# EAGLE design schematic (EAGLE 9.6.2)
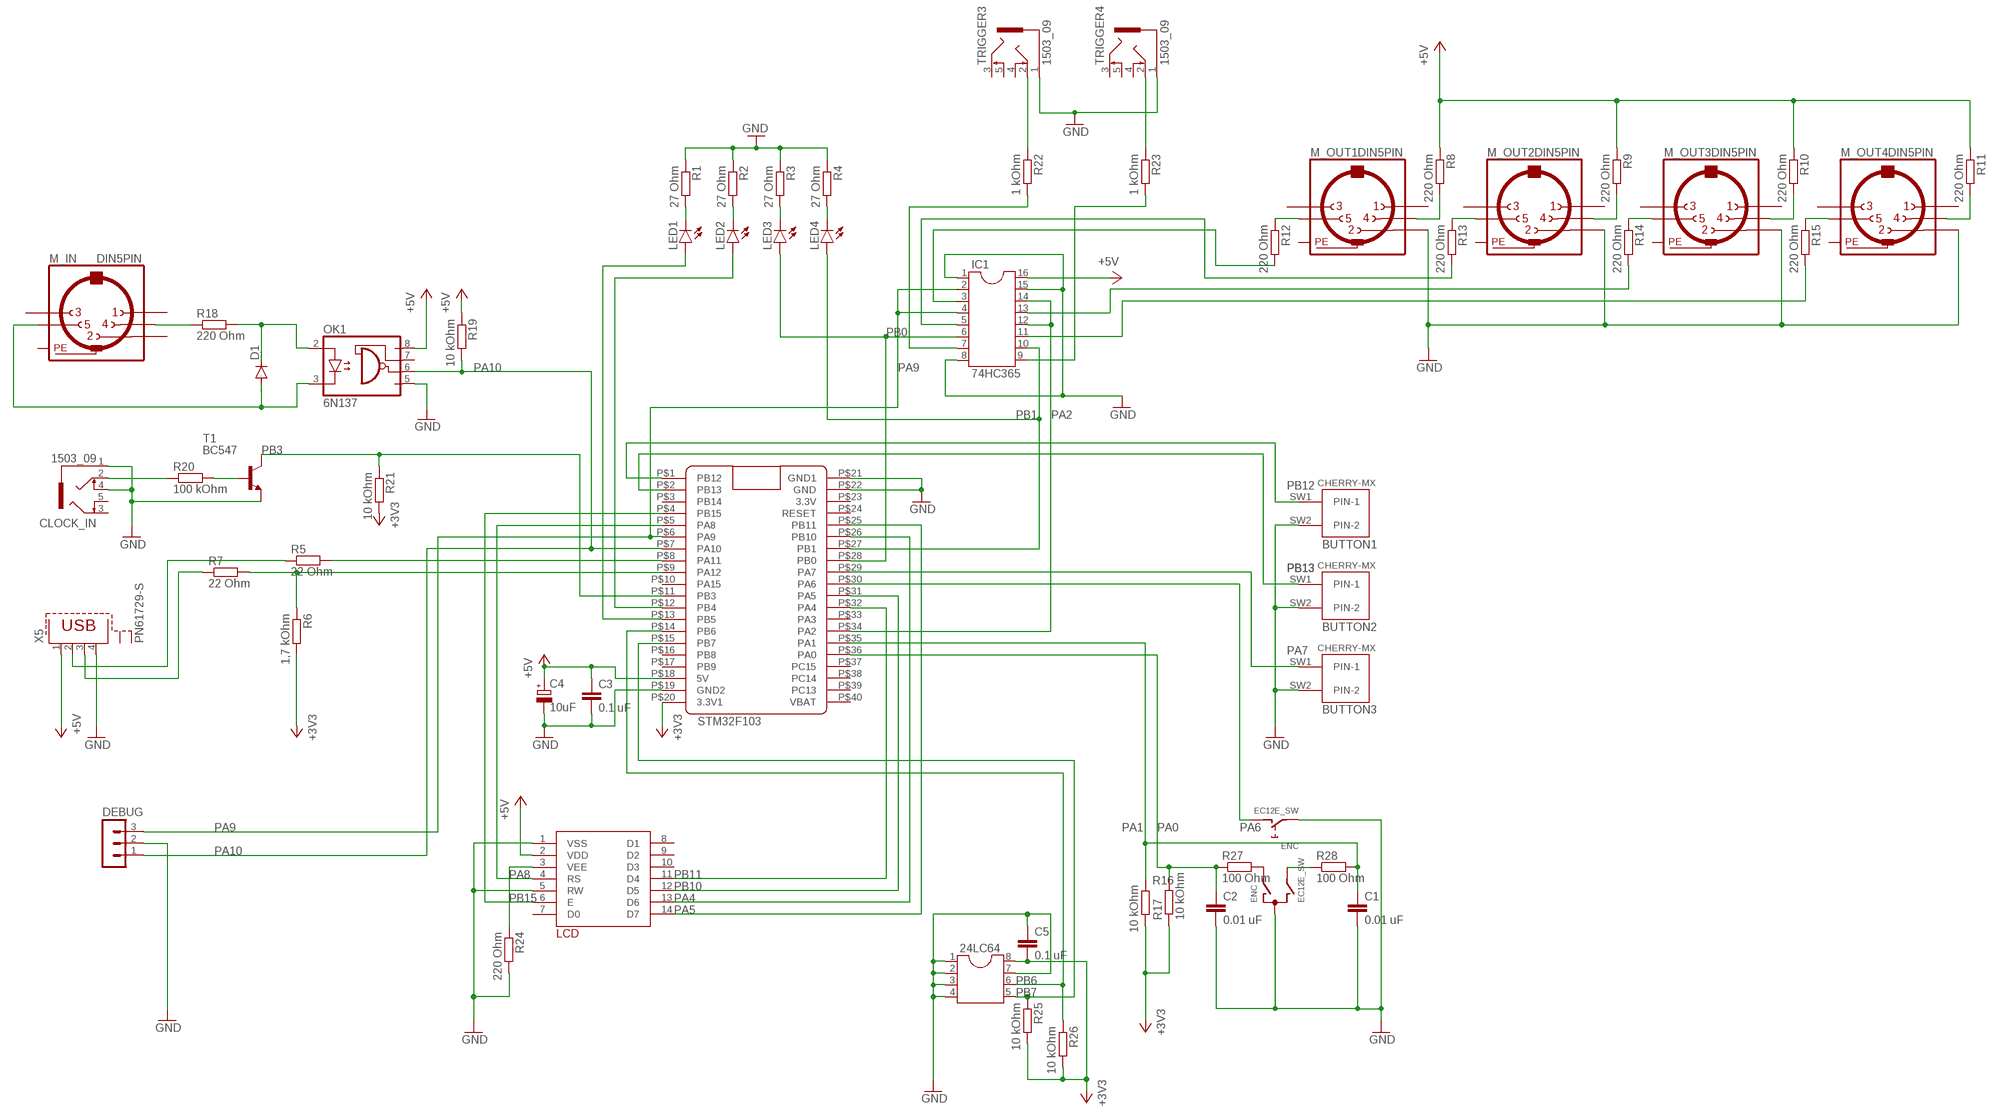
[diagram p0: schematic, sheet 1]

## Parts
24LC64  DIL8  [DIL08]
BUTTON1  CHERRY-MX  [CHERRY-MX]
BUTTON2  CHERRY-MX  [CHERRY-MX]
BUTTON3  CHERRY-MX  [CHERRY-MX]
C1  0.01 uF  C-EU050-025X075  [C050-025X075]
C2  0.01 uF  C-EU050-025X075  [C050-025X075]
C3  0.1 uF  C-EU050-025X075  [C050-025X075]
C4  10uF  CPOL-EUE2.5-6  [E2,5-6]
C5  0.1 uF  C-EU050-025X075  [C050-025X075]
CLOCK_IN  1503_09  [1503_09]
D1  1N4446  [DO35-10]
DEBUG  MA03-1  [MA03-1]
ENC  EC12E_SW  [ALPS_EC12E_SW]
IC1  74HC365  DIL16S  [SOCKET-16]
LCD  LCD-MODUL2X8  [LCD-MODUL2X8]
LED1  LED3MM  [LED3MM]
LED2  LED3MM  [LED3MM]
LED3  LED3MM  [LED3MM]
LED4  LED3MM  [LED3MM]
M_IN  DIN5PIN  [MABPM5S]
M_OUT1  DIN5PIN  [MABPM5S]
M_OUT2  DIN5PIN  [MABPM5S]
M_OUT3  DIN5PIN  [MABPM5S]
M_OUT4  DIN5PIN  [MABPM5S]
OK1  6N137  [DIL08]
R1  27 Ohm  R-EU_0207/10  [0207/10]
R2  27 Ohm  R-EU_0207/10  [0207/10]
R3  27 Ohm  R-EU_0207/10  [0207/10]
R4  27 Ohm  R-EU_0207/10  [0207/10]
R5  22 Ohm  R-EU_0207/10  [0207/10]
R6  1,7 kOhm  R-EU_0207/10  [0207/10]
R7  22 Ohm  R-EU_0207/10  [0207/10]
R8  220 Ohm  R-EU_0207/10  [0207/10]
R9  220 Ohm  R-EU_0207/10  [0207/10]
R10  220 Ohm  R-EU_0207/10  [0207/10]
R11  220 Ohm  R-EU_0207/10  [0207/10]
R12  220 Ohm  R-EU_0207/10  [0207/10]
R13  220 Ohm  R-EU_0207/10  [0207/10]
R14  220 Ohm  R-EU_0207/10  [0207/10]
R15  220 Ohm  R-EU_0207/10  [0207/10]
R16  10 kOhm  R-EU_0207/10  [0207/10]
R17  10 kOhm  R-EU_0207/10  [0207/10]
R18  220 Ohm  R-EU_0207/10  [0207/10]
R19  10 kOhm  R-EU_0207/10  [0207/10]
R20  100 kOhm  R-EU_0207/10  [0207/10]
R21  10 kOhm  R-EU_0207/10  [0207/10]
R22  1 kOhm  R-EU_0207/10  [0207/10]
R23  1 kOhm  R-EU_0207/10  [0207/10]
R24  220 Ohm  R-EU_0207/10  [0207/10]
R25  10 kOhm  R-EU_0207/10  [0207/10]
R26  10 kOhm  R-EU_0207/10  [0207/10]
R27  100 Ohm  R-EU_0207/10  [0207/10]
R28  100 Ohm  R-EU_0207/10  [0207/10]
STM32F103  BLUE_PILL  [BLUE_PILL]
T1  BC547  [TO92]
TRIGGER3  1503_09  [1503_09]
TRIGGER4  1503_09  [1503_09]
X5  PN61729-S  [PN61729-S]

## Nets
+3V3: 24LC64.8 C5.2 R6.2 R16.2 R17.1 R21.2 R25.2 R26.2 STM32F103.P$20(3.3V1)
+5V: C3.1 C4.+ IC1.16 LCD.2(VDD) OK1.8(VCC) R8.1 R9.1 R10.1 R11.1 R19.1 STM32F103.P$18(5V) X5.1
GND: 24LC64.1 24LC64.2 24LC64.3 24LC64.4 24LC64.7 BUTTON1.SW2(PIN-2) BUTTON2.SW2(PIN-2) BUTTON3.SW2(PIN-2) C1.2 C2.2 C3.2 C4.- C5.1 CLOCK_IN.1 CLOCK_IN.4 DEBUG.2 ENC.C ENC.E IC1.1 IC1.8 IC1.15 LCD.1(VSS) LCD.5(RW) M_OUT1.P2 M_OUT2.P2 M_OUT3.P2 M_OUT4.P2 OK1.5(GND) R1.1 R2.1 R3.1 R4.1 R24.2 STM32F103.P$19(GND2) STM32F103.P$21(GND1) STM32F103.P$22(GND) T1.1(E) TRIGGER3.1 TRIGGER4.1 X5.4
N$1: R5.1 X5.2
N$2: R5.2 STM32F103.P$8(PA11)
N$3: R7.1 X5.3
N$4: LED1.K(C) R1.2
N$5: LED2.K(C) R2.2
N$6: LED3.K(C) R3.2
N$7: LED4.K(C) R4.2
N$8: R6.1 R7.2 STM32F103.P$9(PA12)
N$9: M_OUT1.P4 R8.2
N$10: M_OUT2.P4 R9.2
N$11: M_OUT3.P4 R10.2
N$12: M_OUT4.P4 R11.2
N$13: M_OUT1.P5 R12.1
N$14: M_OUT2.P5 R13.1
N$15: M_OUT3.P5 R14.1
N$16: M_OUT4.P5 R15.1
N$17: IC1.3 R12.2
N$18: IC1.5 R13.2
N$19: IC1.13 R14.2
N$20: IC1.11 R15.2
N$21: ENC.A R27.2
N$22: ENC.B R28.1
N$24: D1.C OK1.2(A) R18.2
N$25: D1.A M_IN.P5 OK1.3(C)
N$26: M_IN.P4 R18.1
N$27: LCD.3(VEE) R24.1
N$28: CLOCK_IN.2 R20.1
N$29: R20.2 T1.2(B)
N$30: R22.1 TRIGGER3.2
N$31: IC1.7 R22.2
N$33: R23.1 TRIGGER4.2
N$34: IC1.9 R23.2
PA0: C2.1 R17.2 R27.1 STM32F103.P$36(PA0)
PA1: C1.1 R16.1 R28.2 STM32F103.P$35(PA1)
PA2: IC1.12 IC1.14 STM32F103.P$34(PA2)
PA4: LCD.11(D4) STM32F103.P$32(PA4)
PA5: LCD.12(D5) STM32F103.P$31(PA5)
PA6: ENC.D STM32F103.P$30(PA6)
PA7: BUTTON3.SW1(PIN-1) STM32F103.P$29(PA7)
PA8: LCD.4(RS) STM32F103.P$5(PA8)
PA9: DEBUG.3 IC1.2 IC1.4 STM32F103.P$6(PA9)
PA10: DEBUG.1 OK1.6(VO) R19.2 STM32F103.P$7(PA10)
PB0: IC1.6 LED3.A STM32F103.P$28(PB0)
PB1: IC1.10 LED4.A STM32F103.P$27(PB1)
PB3: R21.1 STM32F103.P$11(PB3) T1.3(C)
PB4: LED2.A STM32F103.P$12(PB4)
PB5: LED1.A STM32F103.P$13(PB5)
PB6: 24LC64.6 R26.1 STM32F103.P$14(PB6)
PB7: 24LC64.5 R25.1 STM32F103.P$15(PB7)
PB10: LCD.13(D6) STM32F103.P$26(PB10)
PB11: LCD.14(D7) STM32F103.P$25(PB11)
PB12: BUTTON1.SW1(PIN-1) STM32F103.P$1(PB12)
PB13: BUTTON2.SW1(PIN-1) STM32F103.P$2(PB13)
PB15: LCD.6(E) STM32F103.P$4(PB15)
Unconnected: CLOCK_IN.3 CLOCK_IN.5 ENC.GND1(G) ENC.GND2(G) LCD.7(D0) LCD.8(D1) LCD.9(D2) LCD.10(D3) M_IN.P1 M_IN.P2 M_IN.P3 M_OUT1.P1 M_OUT1.P3 M_OUT2.P1 M_OUT2.P3 M_OUT3.P1 M_OUT3.P3 M_OUT4.P1 M_OUT4.P3 OK1.7(VE) STM32F103.P$3(PB14) STM32F103.P$10(PA15) STM32F103.P$16(PB8) STM32F103.P$17(PB9) STM32F103.P$23(3.3V) STM32F103.P$24(RESET) STM32F103.P$33(PA3) STM32F103.P$37(PC15) STM32F103.P$38(PC14) STM32F103.P$39(PC13) STM32F103.P$40(VBAT) TRIGGER3.3 TRIGGER3.4 TRIGGER3.5 TRIGGER4.3 TRIGGER4.4 TRIGGER4.5 X5.S1 X5.S2

## Notes on the sheet
- STM32F103

## Power pins joined to a net without a drawn wire
PE: M_IN.PE M_IN.PE@(PE) M_OUT1.PE M_OUT1.PE@(PE) M_OUT2.PE M_OUT2.PE@(PE) M_OUT3.PE M_OUT3.PE@(PE) M_OUT4.PE M_OUT4.PE@(PE)

## Library data of the parts
24LC64 = ic-package:DIL8: Dual In Line / Socket
BUTTON1-BUTTON3 = cherrymx:CHERRY-MX: Cherry MX series keyswitch
C1-C3 C5 = rcl:C-EU: CAPACITOR, European symbol; SPICEPREFIX: C
C4 = rcl:CPOL-EU: POLARIZED CAPACITOR, European symbol; SPICEPREFIX: C
CLOCK_IN TRIGGER3 TRIGGER4 = con-lumberg:1503_09: Jack connectors according to JISC 6560, 3.5 mm Klinkeneinbaukupplung nach JISC 6560, 3,5 mm, 3-polig/ stereo, abgewinkelte Ausführung, mit 2 Öffnern und Lötaugen, für Leiterplatten Rückseitenmontage Source: http://www.lumberg.com/Produkte/PDFs/1503_09.pdf; OC_FARNELL: 1243244; OC_NEWARK: unknown
D1 = diode:1N4446: DIODE high speed (Philips)
DEBUG = con-lstb:MA03-1: PIN HEADER; OC_FARNELL: unknown; OC_NEWARK: unknown
ENC = switch-alps:EC12E_SW: ALPS rotary Encoder EC12E series with switch; MPN: EC12E2424407; OC_FARNELL: 1520813; OC_NEWARK: 74M1068
IC1 = ic-package:DIL16: Dual In Line / Socket
LCD = lcd082dip:LCD-MODUL2X8
LED1-LED4 = led:LED: LED OSRAM: - CHIPLED LG R971, LG N971, LY N971, LG Q971, LY Q971, LO R971, LY R971 LH N974, LH R974 LS Q976, LO Q976, LY Q976 LO Q996 - Hyper CHIPLED LW Q18S LB Q993, LB Q99A, LB R99A - SideLED LS A670, LO A670, LY A670, LG A670, LP A670 LB A673, LV A673, LT A673, LW A673 LH A674 LY A675 LS A676, LA A676, LO A676, LY A676, LW A676 LS A679, LY A679, LG A679 - Hyper Micro SIDELED® LS Y876, LA Y876, LO Y876, LY Y876 LT Y87S - SmartLED LW L88C, LW L88S LB L89C, LB L89S, LG L890 LS L89K, LO L89K, LY L89K LS L896, LA L896, LO L896, LY L896 - TOPLED LS T670, LO T670, LY T670, LG T670, LP T670 LSG T670, LSP T670, LSY T670, LOP T670, LYG T670 LG T671, LOG T671, LSG T671 LB T673, LV T673, LT T673, LW T673 LH T674 LS T676, LA T676, LO T676, LY T676, LB T676, LH T676, LSB T676, LW T676 LB T67C, LV T67C, LT T67C, LS T67K, LO T67K, LY T67K, LW E67C LS E67B, LA E67B, LO E67B, LY E67B, LB E67C, LV E67C, LT E67C LW T67C LS T679, LY T679, LG T679 LS T770, LO T770, LY T770, LG T770, LP T770 LB T773, LV T773, LT T773, LW T773 LH T774 LS E675, LA E675, LY E675, LS T675 LS T776, LA T776, LO T776, LY T776, LB T776 LHGB T686 LT T68C, LB T68C - Hyper Mini TOPLED® LB M676 - Mini TOPLED Santana® LG M470 LS M47K, LO M47K, LY M47K Source: http://www.osram.convergy.de LUXEON: - LUMILED® LXK2-PW12-R00, LXK2-PW12-S00, LXK2-PW14-U00, LXK2-PW14-V00 LXK2-PM12-R00, LXK2-PM12-S00, LXK2-PM14-U00 LXK2-PE12-Q00, LXK2-PE12-R00, LXK2-PE12-S00, LXK2-PE14-T00, LXK2-PE14-U00 LXK2-PB12-K00, LXK2-PB12-L00, LXK2-PB12-M00, LXK2-PB14-N00, LXK2-PB14-P00, LXK2-PB14-Q00 LXK2-PR12-L00, LXK2-PR12-M00, LXK2-PR14-Q00, LXK2-PR14-R00 LXK2-PD12-Q00, LXK2-PD12-R00, LXK2-PD12-S00 LXK2-PH12-R00, LXK2-PH12-S00 LXK2-PL12-P00, LXK2-PL12-Q00, LXK2-PL12-R00 Source: www.luxeon.com KINGBRIGHT: KA-3528ASYC Source: www.kingbright.com
M_IN M_OUT1-M_OUT4 = DIN_5pin:DIN5PIN
OK1 = optocoupler:6N137: MOTOROLA OPTO COUPLER; MPN: 6N137; OC_FARNELL: 1328376; OC_NEWARK: 52M1895
R1-R28 = rcl:R-EU_: RESISTOR, European symbol; SPICEPREFIX: R
STM32F103 = BluePill:BLUE_PILL
T1 = transistor:BC547: NPN TRANSISTOR
X5 = con-berg:PN61729-S: BERG USB connector; OC_FARNELL: unknown; OC_NEWARK: unknown

## Board
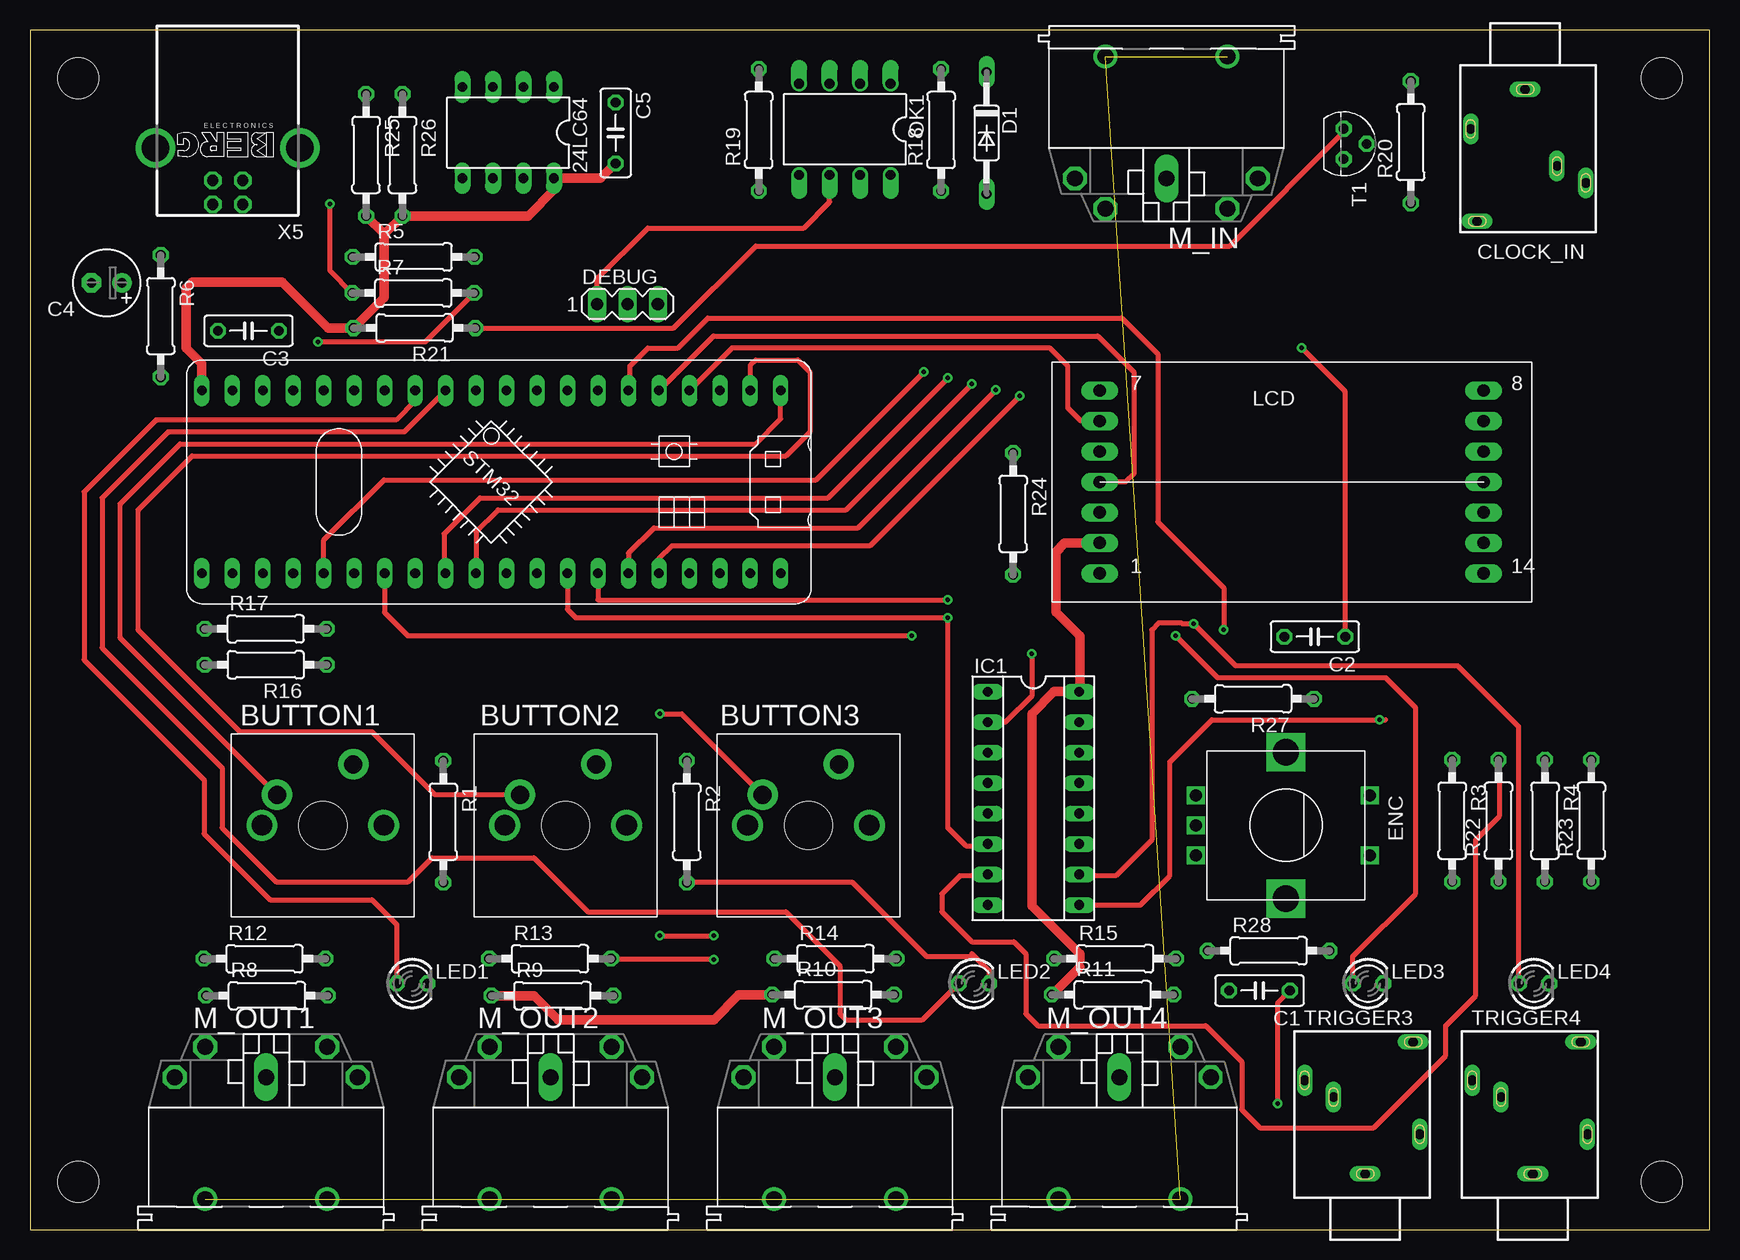
[diagram p1: board, top side]
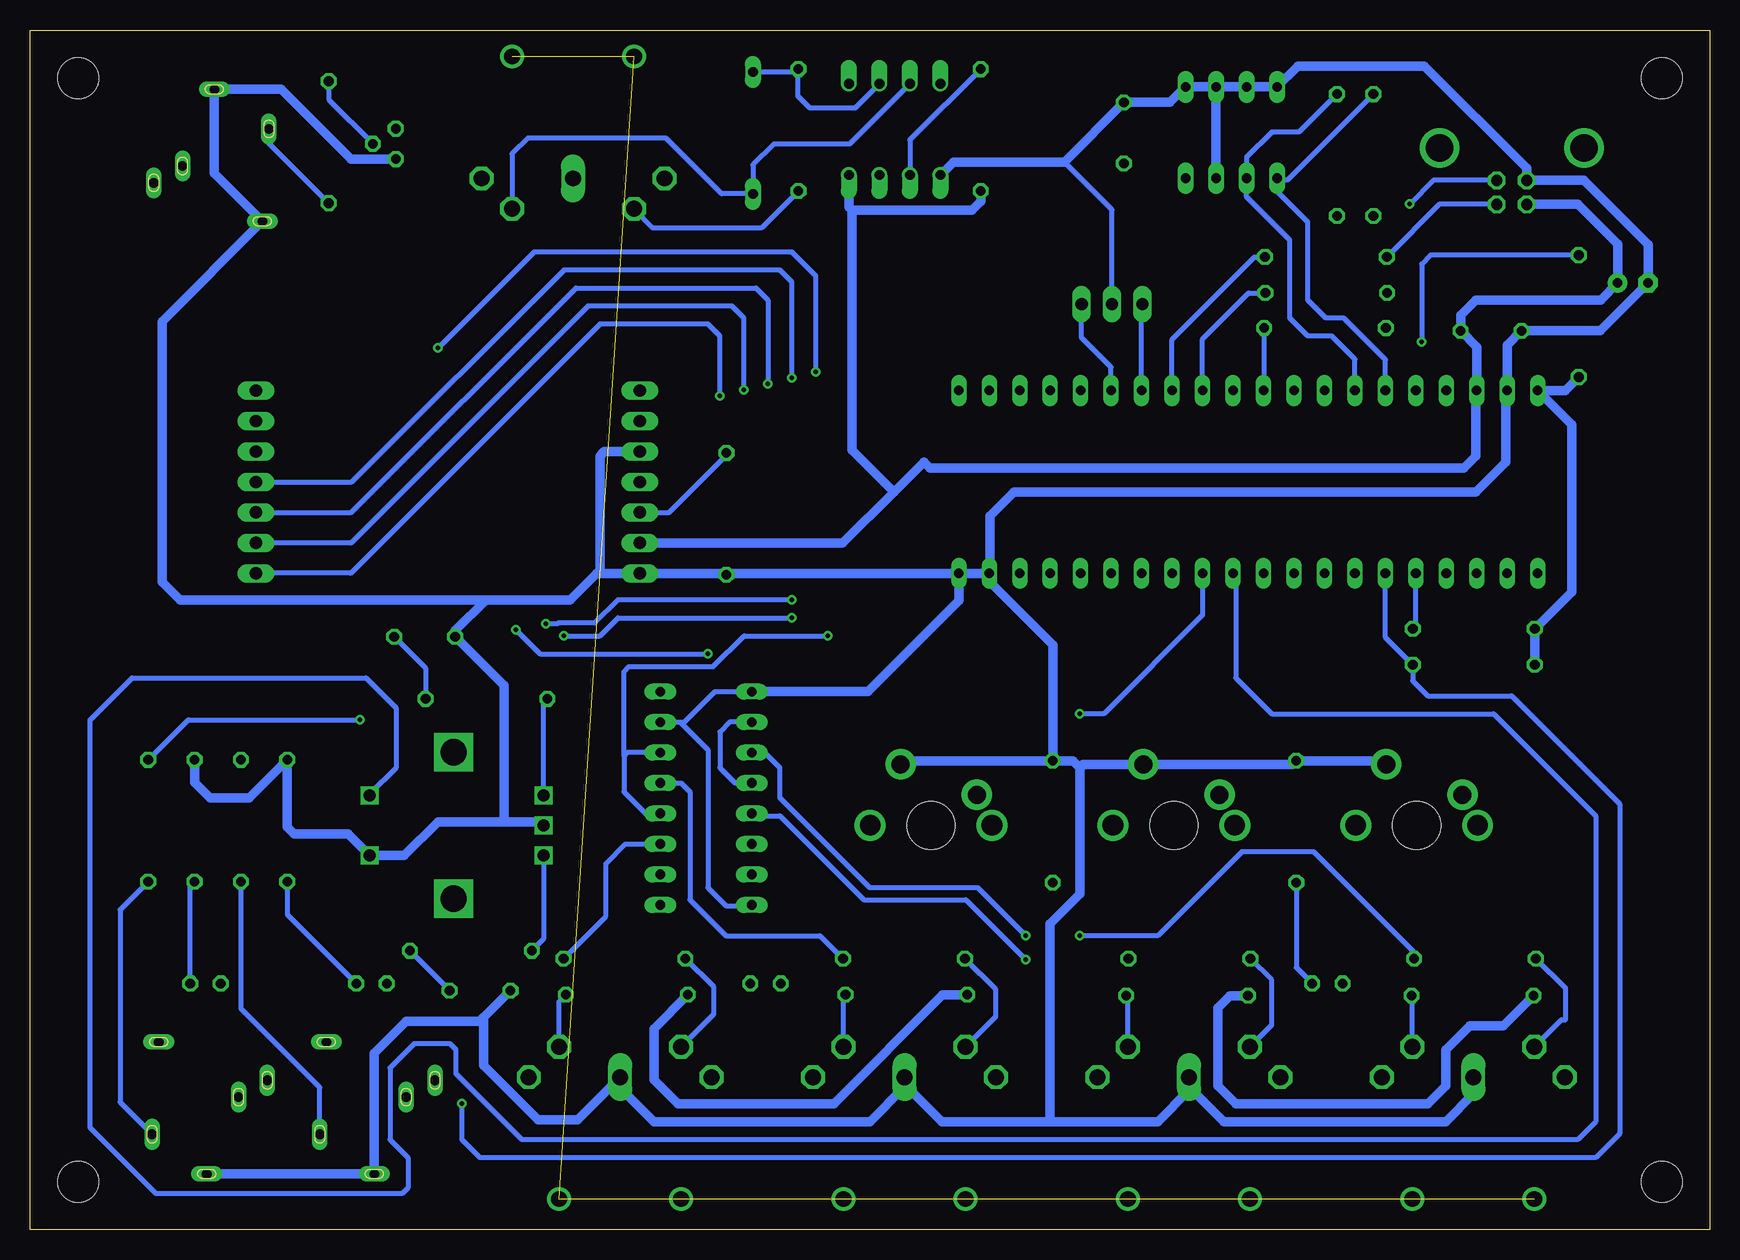
[diagram p2: board, bottom side, seen from below]

Size 140 x 100 mm. Coordinates in mm from the lower left corner, seen from the top.
Outline: 0,0 140,0 140,100 0,100 0,0
Copper layers (1*16): Top 0.035mm / dielectric 1.5mm / Bottom 0.035mm
Design rules "default *": minimum track width 6mil, minimum drill 0.35mm, track to track 0.2mm, track to pad 0.2mm, pad to pad 0.5mm, via to via 0.5mm, smd to smd 6mil, copper to edge 40mil, drill to drill 6mil, minimum pad ring 10mil, minimum via ring 8mil, stop-mask expansion 4mil, vias tented up to drill 0mil, thermal gap 10mil
Holes 3.4 mm at 4,96 136,96 136,4 4,4

### Footprints (pad centres in the part's own frame; a part is rotated, then mirrored left to right if it is on the bottom)
DIL08 = drill 0.813 long: 1 -3.81,-3.81; 2 -1.27,-3.81; 3 1.27,-3.81; 4 3.81,-3.81; 5 3.81,3.81; 6 1.27,3.81; 7 -1.27,3.81; 8 -3.81,3.81
CHERRY-MX = drill 1.714 pad 1.93: P$3 -5.08,0; P$4 5.08,0 | drill 1.5 pad 2.54: SW1 -3.81,2.54; SW2 2.54,5.08 | hole 4: 0,0
C050-025X075 = drill 0.813 octagon: 1 -2.54,0; 2 2.54,0
E2,5-6 = drill 0.813 pad 1.6: + -1.27,0 | drill 0.813 pad 1.6 octagon: - 1.27,0
1503_09 = drill 0.8 pad 1.2 long: 1 0,-2.1; 2 -4.55,-5.4; 3 5.05,-9.9; 4 -4,-13.1; 5 2.65,-8.5
DO35-10 = drill 0.813 long: A 5.08,0; C -5.08,0
MA03-1 = drill 1.016 long: 1 -2.54,0; 2 0,0; 3 2.54,0
ALPS_EC12E_SW = drill 1 square: A -2.5,-7.5; B 2.5,-7.5; C 0,-7.5; D -2.5,7; E 2.5,7 | drill 2.2 square: GND1 -6.1,0; GND2 6.1,0
SOCKET-16 = drill 0.813 long: 1 -8.89,-3.81; 2 -6.35,-3.81; 3 -3.81,-3.81; 4 -1.27,-3.81; 5 1.27,-3.81; 6 3.81,-3.81; 7 6.35,-3.81; 8 8.89,-3.81; 9 8.89,3.81; 10 6.35,3.81; 11 3.81,3.81; 12 1.27,3.81; 13 -1.27,3.81; 14 -3.81,3.81; 15 -6.35,3.81; 16 -8.89,3.81
LCD-MODUL2X8 = drill 1.016 long: 1 -16.51,-7.62; 2 -16.51,-5.08; 3 -16.51,-2.54; 4 -16.51,0; 5 -16.51,2.54; 6 -16.51,5.08; 7 -16.51,7.62; 8 15.49,7.62; 9 15.49,5.08; 10 15.49,2.54; 11 15.49,0; 12 15.49,-2.54; 13 15.49,-5.08; 14 15.49,-7.62
LED3MM = drill 0.813 octagon: A -1.27,0; K 1.27,0
MABPM5S = drill 1.321 octagon: P1 7.62,5.08; P3 -7.62,5.08; P4 5.08,7.62; P5 -5.08,7.62 | drill 1.321 long: P2 0,5.08 | drill 1.321: PE -5.08,-5.08; PE@ 5.08,-5.08
DIL08' = drill 0.813 offset: 1 -3.81,-3.81; 2 -1.27,-3.81; 3 1.27,-3.81; 4 3.81,-3.81; 5 3.81,3.81; 6 1.27,3.81; 7 -1.27,3.81; 8 -3.81,3.81
0207/10 = drill 0.813 octagon: 1 -5.08,0; 2 5.08,0
BLUE_PILL = drill 0.8 long: P$1 -7.62,15.24; P$2 -7.62,12.7; P$3 -7.62,10.16; P$4 -7.62,7.62; P$5 -7.62,5.08; P$6 -7.62,2.54; P$7 -7.62,0; P$8 -7.62,-2.54; P$9 -7.62,-5.08; P$10 -7.62,-7.62; P$11 -7.62,-10.16; P$12 -7.62,-12.7; P$13 -7.62,-15.24; P$14 -7.62,-17.78; P$15 -7.62,-20.32; P$16 -7.62,-22.86; P$17 -7.62,-25.4; P$18 -7.62,-27.94; P$19 -7.62,-30.48; P$20 -7.62,-33.02; P$21 7.62,15.24; P$22 7.62,12.7; P$23 7.62,10.16; P$24 7.62,7.62; P$25 7.62,5.08; P$26 7.62,2.54; P$27 7.62,0; P$28 7.62,-2.54; P$29 7.62,-5.08; P$30 7.62,-7.62; P$31 7.62,-10.16; P$32 7.62,-12.7; P$33 7.62,-15.24; P$34 7.62,-17.78; P$35 7.62,-20.32; P$36 7.62,-22.86; P$37 7.62,-25.4; P$38 7.62,-27.94; P$39 7.62,-30.48; P$40 7.62,-33.02
TO92 = drill 0.813 octagon: 1 1.27,0; 2 0,1.905; 3 -1.27,0
PN61729-S = drill 0.95 octagon: 1 1.25,4.71; 2 -1.25,4.71; 3 -1.25,2.71; 4 1.25,2.71 | drill 2.3 pad 2.9: S1 -6.02,0; S2 6.02,0

### Placement (x,y rotation side)
24LC64  39.86,91.45 180 top
BUTTON1  24.41,33.69 0 top
BUTTON2  44.65,33.69 0 top
BUTTON3  64.89,33.69 0 top
C1  102.49,19.92 180 top
C2  107.1,49.42 180 top
C3  18.21,74.92 180 top
C4  6.39,78.92 180 top
C5  48.82,91.42 270 top
CLOCK_IN  124.64,97.16 0 top
D1  79.73,91.42 270 top
DEBUG  49.8,77.15 0 top
ENC  104.69,33.69 270 top
IC1  83.64,35.95 270 top
LCD  105.68,62.33 0 top
LED1  31.85,20.51 0 top
LED2  78.69,20.51 0 top
LED3  111.53,20.51 0 top
LED4  125.37,20.51 0 top
M_IN  94.73,92.71 180 top
M_OUT1  19.68,7.62 0 top
M_OUT2  43.39,7.62 0 top
M_OUT3  67.1,7.62 0 top
M_OUT4  90.8,7.62 0 top
OK1  6N137  [DIL08']  67.92,91.72 180 top
R1  34.45,34 270 top
R2  54.75,34 270 top
R3  118.55,34.08 270 top
R4  126.28,34.08 270 top
R5  31.98,81.08 0 top
R6  10.9,76.15 270 top
R7  31.95,78.08 0 top
R8  19.75,19.5 0 top
R9  43.55,19.5 0 top
R10  66.95,19.58 0 top
R11  90.25,19.58 0 top
R12  19.55,22.58 0 top
R13  43.35,22.58 0 top
R14  67.15,22.58 0 top
R15  90.45,22.58 0 top
R16  19.65,47.08 180 top
R17  19.65,50.08 0 top
R18  75.95,91.66 90 top
R19  60.75,91.66 90 top
R20  115.1,90.65 90 top
R21  32.05,75.16 180 top
R22  122.42,34.08 90 top
R23  130.15,34.08 90 top
R24  81.95,59.66 270 top
R25  28.02,89.58 270 top
R26  31.05,89.58 270 top
R27  101.95,44.24 180 top
R28  103.25,23.24 0 top
STM32F103  47.34,62.33 270 top
T1  109.51,90.51 270 top
TRIGGER3  111.3,2.54 180 top
TRIGGER4  125.27,2.54 180 top
X5  16.48,90.17 180 top

### Tracks (layer width: path | path; a pad name or v marks a point on that pad's centre or on a via)
+3V3
  Top 0.8: STM32F103.P$20 14.32,72.18 13,73.5 13,78.5 13.5,79 21,79 24.84,75.16 R21.2 29.5,77.69 29.5,83.02 | R25.2 29.5,83.02 | 29.5,83.02 29.57,83.02 R26.2 41.5,84.5 43.67,86.67 24LC64.8 47.58,87.64 C5.2
  Bottom 0.8: R6.2 12.03,69.94 STM32F103.P$20 11.5,67.12 11.5,53.15 R17.1 R16.2
+5V
  Top 0.4: 87.5,22.5 87.5,21.91
  Top 0.8: 87.5,22.5 87.5,23 83.5,27 83.5,43 85.34,44.84 IC1.16 87.5,44.89 87.5,49.5 85.5,51.5 85.5,56.5 86.25,57.24 LCD.2 | 87.5,21.91 R11.1 | R9.1 42,19.5 44,17.5 57,17.5 59.08,19.58 R10.1
  Bottom 0.8: X5.1 13.54,85.46 13.5,85.5 11,85.5 7.66,82.16 C4.+ 9.08,77.5 19.5,77.5 20.75,76.25 C3.1 19.4,73.57 STM32F103.P$18 19.5,69.84 19.5,64.5 20.5,63.5 65,63.5 65.5,64 68,61.5 | 68,61.5 71.5,65 71.5,85 | R19.1 60.75,85.75 61.5,85 71.5,85 | OK1.8 71.73,85.23 71.5,85 | 68,61.5 72.25,57.24 LCD.2 | R8.1 17.17,17 20,17 22,15 22,12 23.5,10.5 39.5,10.5 41,12 41,18.5 40,19.5 R9.1 | R11.1 88,16.75 88,12.5 86,10.5 73,10.5 63.92,19.58 R10.1
GND
  Bottom 0.4: 82,54.7 82,54.63 R24.2 | DEBUG.2 49.8,85.02 53.78,89 | IC1.1 82.91,44.84 85.45,42.3 IC1.15 85.8,42.3 83.5,40 83.5,28.5 82,27 79.89,27 IC1.8
  Bottom 0.8: 10.46,87.46 X5.4 15.23,88.46 23.77,97 34.31,97 24LC64.4 24LC64.3 24LC64.2 | 10.46,87.46 5.12,82.12 C4.- 9.12,74.92 C3.2 16.86,73.73 STM32F103.P$19 17,69.81 17,64 19.5,61.5 58,61.5 60,59.5 60,54 | 60,54 60.04,54.04 STM32F103.P$22 STM32F103.P$21 | STM32F103.P$21 82,54.7 LCD.1 92.78,54.7 | 10.46,87.46 10.5,87.5 | OK1.5 63.02,89 53.78,89 C5.1 44.97,93.96 24LC64.1 24LC64.2 | 55,9 64,9 67.1,12.1 M_OUT3.P2 67.1,11.9 70,9 88,9 90.81,11.8 M_OUT4.P2 94.36,9.14 97.64,9.14 102.19,13.69 102.19,17.68 | 55,9 46,9 43.39,11.61 M_OUT2.P2 43.39,11.89 40.5,9 22,9 19.68,11.31 M_OUT1.P2 | 55,9 55,25.5 52.5,28 52.5,38.5 | 52.5,38.5 53.08,39.08 R2.1 | R2.1 54.75,48.75 60,54 | 52.5,38.5 52.23,38.77 BUTTON2.SW2 34.76,38.77 R1.1 27.26,39.08 BUTTON1.SW2 | TRIGGER4.1 TRIGGER3.1 111.3,14.7 108.63,17.37 102.5,17.37 102.19,17.68 | 92.78,54.7 94.99,52.49 102,52.49 | 102.19,17.68 C1.2 | R4.1 126.28,37.28 125,36 121.71,36 R3.1 118.55,33.55 118,33 113.5,33 ENC.E 108.81,31.19 106,34 100.5,34 | 100.5,34 97.5,34 ENC.C | T1.1 113.24,89.24 119.06,95.06 CLOCK_IN.1 124.64,88.06 CLOCK_IN.4 129,75.69 129,54 127.49,52.49 102,52.49 | IC1.1 70.16,44.84 62.58,52.42 STM32F103.P$21 | 92.78,54.7 92.5,54.98 92.5,64.5 92.14,64.86 LCD.5 | 102,52.49 104.56,49.93 C2.2 100.5,45.36 100.5,34 | 24LC64.7 24LC64.2 | R2.1 67.12,39.08 BUTTON3.SW2
N$1
  Bottom 0.4: X5.2 22.52,85.46 R5.1
N$2
  Bottom 0.4: STM32F103.P$8 44.8,74.2 37.92,81.08 R5.2
N$3  (via drill 0.35)
  Top 0.4: R7.1 25,79.95 v25,85.5
  Bottom 0.4: X5.3 23.04,87.46 v25,85.5
N$4
  Bottom 0.4: R1.2 34.45,21.84 LED1.K
N$5
  Top 0.4: LED2.K 79.96,21.46 80,21.5 78.75,22.75 | 78.75,22.75 78.5,23 | 78.75,22.75 74.75,22.75 68.58,28.92 R2.2
N$6
  Bottom 0.4: R3.2 118.55,26.26 LED3.K
N$7
  Bottom 0.4: LED4.K 126.64,28.64 R4.2
N$8  (via drill 0.35)
  Top 0.4: R7.2 32.95,74 v24,74
  Bottom 0.4: STM32F103.P$9 42.26,74.24 38.42,78.08 R7.2 | R6.1 23.27,81.23 24,80.5 v24,74
N$9
  Bottom 0.4: M_OUT1.P4 24.77,19.43 R8.2
N$10
  Bottom 0.4: M_OUT2.P4 48.47,19.34 R9.2
N$11
  Bottom 0.4: M_OUT3.P4 72.18,19.43 R10.2
N$12
  Bottom 0.4: M_OUT4.P4 95.89,19.02 R11.2
N$13
  Bottom 0.4: M_OUT1.P5 12.35,17.5 12,17.5 12,20.11 R12.1
N$14
  Bottom 0.4: M_OUT2.P5 36.5,17.05 36.5,20.81 R13.1
N$15
  Bottom 0.4: M_OUT3.P5 59.5,17.76 59.5,20.01 R14.1
N$16
  Bottom 0.4: M_OUT4.P5 83,17.96 83,20.21 R15.1
N$17  (via drill 0.35)
  Top 0.4: v52.5,24.5 v57,24.5
  Bottom 0.4: R12.2 24.63,23.13 33,31.5 39,31.5 46,24.5 v52.5,24.5 | v57,24.5 61,28.5 70,28.5 77.5,36 77.5,38.5 78.76,39.76 IC1.3
N$18  (via drill 0.35)
  Top 0.4: R13.2 56.92,22.58 v57,22.5
  Bottom 0.4: IC1.5 79.65,34.5 77.5,34.5 70.5,27.5 62,27.5 v57,22.5
N$19
  Bottom 0.4: IC1.13 85.72,37.22 85,36.5 85,27.5 82,24.5 74.15,24.5 R14.2
N$20
  Bottom 0.4: R15.2 92,26.11 92,30.5 90.36,32.14 IC1.11
N$21
  Bottom 0.4: ENC.A 97.19,43.92 R27.2
N$22
  Bottom 0.4: ENC.B 97.19,24.22 R28.1
N$24
  Bottom 0.4: OK1.2 71.22,93.5 75,93.5 76,94.5 76,96.69 R18.2 76.19,96.5 D1.C
N$25
  Bottom 0.4: OK1.3 71.68,90.5 78,90.5 79.73,88.77 D1.A 82.34,86.34 87,91 98.5,91 99.81,89.69 M_IN.P5
N$26
  Bottom 0.4: R18.1 79.03,83.5 88.06,83.5 M_IN.P4
N$27
  Bottom 0.4: LCD.3 86.72,59.78 81.95,64.55 R24.1
N$28
  Bottom 0.4: R20.1 120.08,90.56 CLOCK_IN.2
N$29
  Bottom 0.4: R20.2 115.1,94.19 T1.2
N$30
  Bottom 0.4: TRIGGER3.2 115.85,11.85 122.42,18.42 R22.1
N$31
  Top 0.4: IC1.7 79.73,29.5 77.5,29.5 76,28 76,26.5 78.5,24 82,24 83,23 83,18 84,17 98,17 101,14 101,10 102.5,8.5 112,8.5 118,14.5 118,17 120.5,19.5 120.5,32.5 122.5,34.5 122.5,39.08 R22.2
N$33
  Bottom 0.4: R23.1 132.5,26.65 132.5,10.62 TRIGGER4.2
N$34  (via drill 0.35)
  Top 0.4: IC1.9 92.56,27.06 95,29.5 95,39 98.5,42.5 v112.5,42.5 113,42.5
  Bottom 0.4: R23.2 126.81,42.5 v112.5,42.5
PA0  (via drill 0.35)
  Top 0.4: v74.5,71.5 65.5,62.5 29.5,62.5 24.48,57.48 STM32F103.P$36 | C2.1 109.64,69.86 v106,73.5
  Bottom 0.4: R17.2 24.48,50.33 STM32F103.P$36 | C2.1 107.03,46.81 R27.1 | v74.5,71.5 74.5,79.5 76.5,81.5 98,81.5 v106,73.5
PA1  (via drill 0.35)
  Top 0.4: v104,10.5 104,18.89 C1.1
  Bottom 0.4: STM32F103.P$35 27.02,49.37 R16.1 24.73,45.73 23.5,44.5 16.5,44.5 7.5,35.5 7.5,8 9.5,6 102.5,6 104,7.5 v104,10.5 | C1.1 108.33,23.22 R28.2
PA2  (via drill 0.35)
  Top 0.4: STM32F103.P$34 29.56,51.44 31.5,49.5 v73.5,49.5
  Bottom 0.4: 87.27,34.5 87.39,34.62 | 87.39,34.62 IC1.12 | 87.39,34.62 88.61,34.62 90.5,36.5 90.5,39.5 | 88.74,39.76 IC1.14 90.24,39.76 90.5,39.5 | 90.5,39.5 90.5,46.5 90.08,46.92 83.05,46.92 80.47,49.5 v73.5,49.5
PA4  (via drill 0.35)
  Top 0.4: STM32F103.P$32 34.5,54.84 34.5,58 37.5,61 66.5,61 v76.5,71
  Bottom 0.4: LCD.11 113.17,62.33 95.5,80 77.5,80 76.5,79 v76.5,71
PA5  (via drill 0.35)
  Top 0.4: STM32F103.P$31 37.18,58.18 39,60 68,60 v78.5,70.5
  Bottom 0.4: LCD.12 113.22,59.78 94.5,78.5 79.5,78.5 78.5,77.5 v78.5,70.5
PA6
  Bottom 0.4: STM32F103.P$30 39.5,54.48 39.5,46 36.5,43 18,43 9.5,34.5 9.5,9 11,7.5 99,7.5 104.5,13 104.5,15 105,15.5 108,15.5 110,13.5 110,7.5 108.5,6 108.5,3.5 109,3 129.5,3 135,8.5 135,42.5 131.5,46 112,46 109.5,43.5 109.5,38.5 111.69,36.31 ENC.D
PA7  (via drill 0.35)
  Top 0.4: BUTTON3.SW1 54.31,43 v52.5,43
  Bottom 0.4: STM32F103.P$29 42.26,51.24 50.5,43 v52.5,43
PA8
  Top 0.4: STM32F103.P$5 56.98,74.5 89,74.5 92,71.5 92,63 91.33,62.33 LCD.4
PA9  (via drill 0.35)
  Top 0.4: STM32F103.P$6 50,70.06 50,72 51.5,73.5 54,73.5 56.5,76 91,76 94,73 94,59 99.5,53.5 v99.5,50 | IC1.2 81.3,42.3 83.5,44.5 v83.5,48
  Bottom 0.4: STM32F103.P$6 49.88,71.88 52.34,74.34 DEBUG.3 52.49,77 | IC1.2 81.7,42.3 82.5,41.5 82.5,38.5 81.22,37.22 IC1.4 | v99.5,50 97.5,48 v83.5,48
PA10
  Top 0.4: DEBUG.1 47.26,79.26 51.5,83.5 64.5,83.5 66.65,85.65 OK1.6
  Bottom 0.4: STM32F103.P$7 47.34,77.07 DEBUG.1 | R19.2 66.65,90.84 OK1.6
PB0  (via drill 0.35)
  Top 0.4: STM32F103.P$28 44.8,51.7 45.5,51 v76.5,51 76.5,33.5 78,32 79.69,32 IC1.6 | LED3.A 110.26,22.76 115.5,28 115.5,43.5 113,46 99,46 v95.5,49.5
  Bottom 0.4: v95.5,49.5 92.5,49.5 91,51 v76.5,51
PB1  (via drill 0.35)
  Top 0.4: STM32F103.P$27 47.34,52.5 v76.5,52.5 | IC1.10 87.55,29.5 90.5,29.5 93.5,32.5 93.5,50 94.08,50.58 95.95,50.58 96.03,50.5 v97,50.5 100.5,47 119,47 124.1,41.9 LED4.A
  Bottom 0.4: v76.5,52.5 91,52.5 92.92,50.58 95.95,50.58 96.03,50.5 v97,50.5
PB3
  Top 0.4: R21.1 53.66,75.16 60.5,82 100,82 109.51,91.51 T1.3
  Bottom 0.4: R21.1 37.13,70 STM32F103.P$11
PB4
  Top 0.4: STM32F103.P$12 31.2,66.5 11.5,66.5 6,61 6,48.5 16,38.5 16,33.5 20.5,29 31.5,29 33.5,31 42,31 46.5,26.5 63,26.5 67.5,22 67.5,18 68,17.5 74.41,17.5 LED2.A
PB5
  Top 0.4: STM32F103.P$13 32.1,69.1 30.5,67.5 10.5,67.5 4.5,61.5 4.5,47.5 14.5,37.5 14.5,33 20,27.5 28.5,27.5 30.58,25.42 LED1.A
PB6
  Bottom 0.4: STM32F103.P$14 29.56,72.56 31.5,74.5 33.5,74.5 35,76 35,82.5 38.59,86.09 24LC64.6 38.59,89.41 36.5,91.5 34.21,91.5 R26.1
PB7
  Bottom 0.4: STM32F103.P$15 27.02,72.52 30.5,76 32,76 33.5,77.5 33.5,84 36.05,86.55 36.05,87.5 | 36.05,87.5 24LC64.5 | R25.1 35.18,87.5 36.05,87.5
PB10  (via drill 0.35)
  Top 0.4: STM32F103.P$26 49.88,56.38 52,58.5 69,58.5 v80.5,70
  Bottom 0.4: 113.25,57.24 113.25,57.25 | 113.25,57.25 93.5,77 81.5,77 80.5,76 v80.5,70 | 113.25,57.25 LCD.13
PB11  (via drill 0.35)
  Top 0.4: v82.5,69.5 70,57 53.5,57 52.42,55.92 STM32F103.P$25
  Bottom 0.4: 113.3,54.7 113.25,54.75 | 113.25,54.75 92.5,75.5 83.5,75.5 82.5,74.5 v82.5,69.5 | 113.25,54.75 121.12,54.75 LCD.14
PB12
  Top 0.4: BUTTON1.SW1 7.5,49.33 7.5,60.5 12.5,65.5 60.5,65.5 62.58,67.58 STM32F103.P$1
PB13
  Top 0.4: BUTTON2.SW1 33.77,36.23 28.5,41.5 17.5,41.5 9,50 9,60 13.5,64.5 63,64.5 65,66.5 65,71.5 64,72.5 60.5,72.5 60.04,72.04 STM32F103.P$2
PB15
  Top 0.4: STM32F103.P$4 58.52,73.5 85,73.5 86.5,72 86.5,68.5 87.59,67.41 LCD.6 88.09,67.41
PE  (9 unrouted)

### Text on the board
tNames: BUTTON1 | BUTTON2 | BUTTON3